# Altium schematic sheet Sheet1.SchDoc
size 431 x 279 mm; SheetNumber: 1; SheetTotal: 2
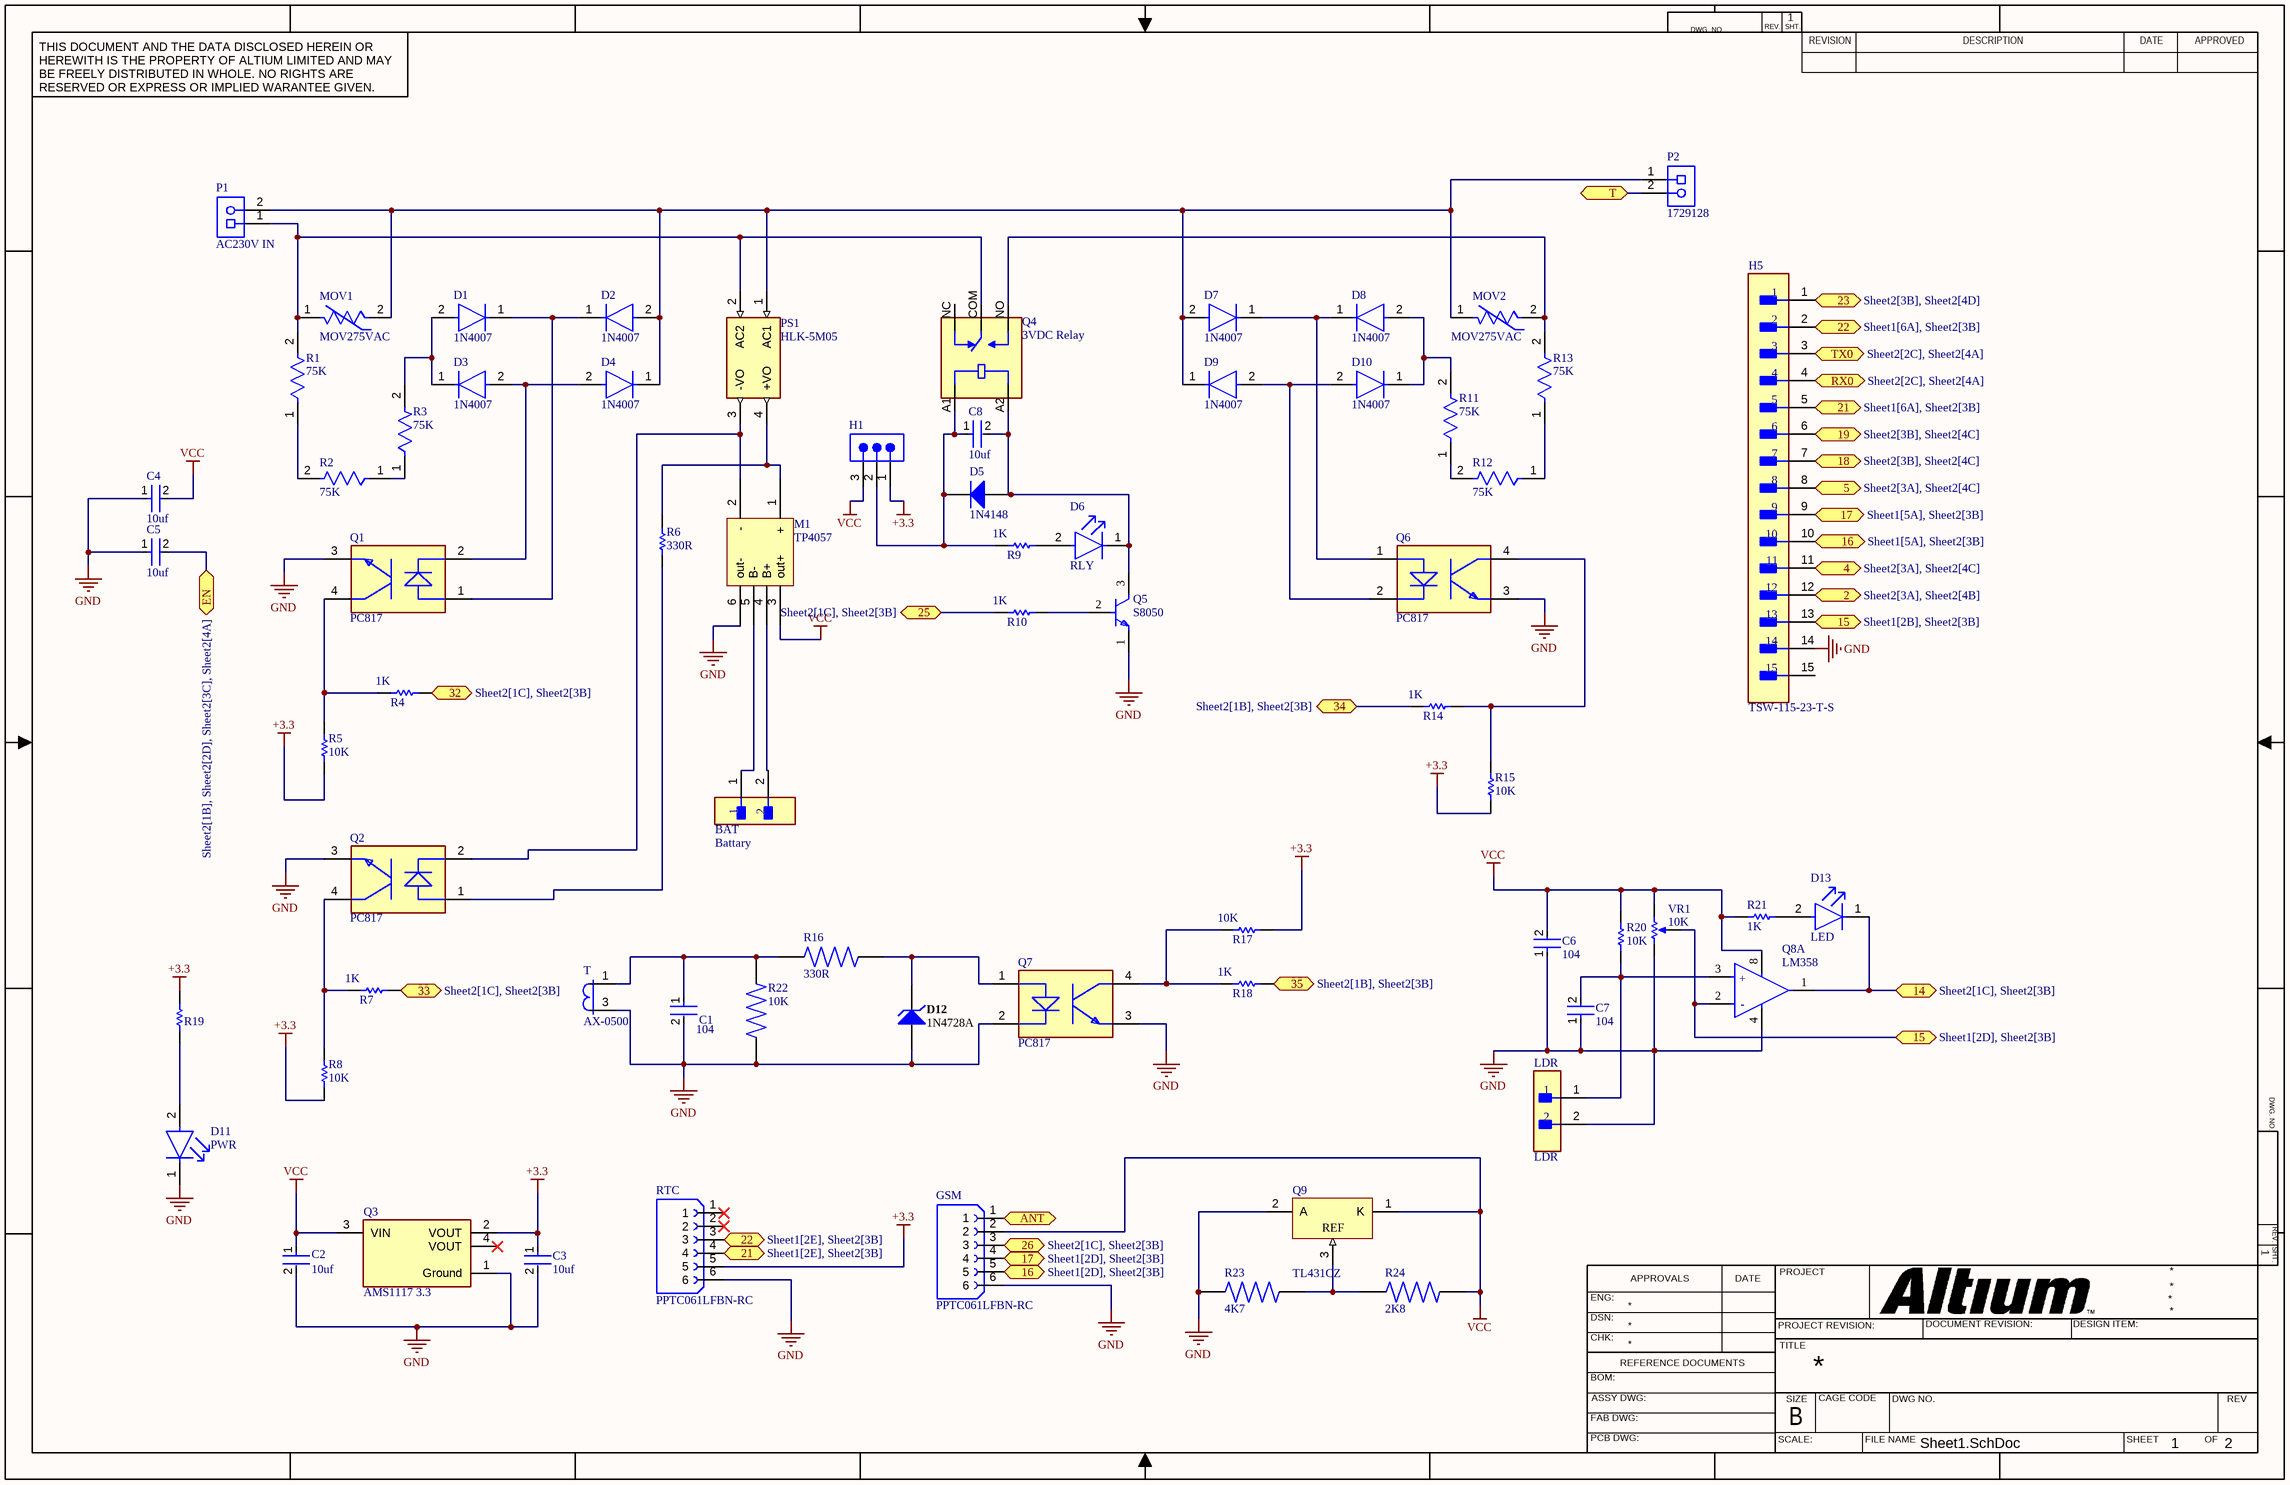
[diagram p0: Sheet1.SchDoc]

## Parts
BAT  Battary  [FP-B2B-XH-AM_LF_SN-MFG]
C1  104  [FP-GRM21B-0_1-MFG]
C2  10uf  [FP-GRM21B-0_1-MFG]
C3  10uf  [FP-GRM21B-0_1-MFG]
C4  10uf  [FP-GRM21B-0_1-MFG]
C5  10uf  [FP-GRM21B-0_1-MFG]
C6  104  [FP-GRM21B-0_1-MFG]
C7  104  [FP-GRM21B-0_1-MFG]
C8  10uf  [FP-GRM21B-0_1-MFG]
D1  1N4007  [FP-1N4007-MFG]
D2  1N4007  [FP-1N4007-MFG]
D3  1N4007  [FP-1N4007-MFG]
D4  1N4007  [FP-1N4007-MFG]
D5  1N4148  [NXP-SOD27-2_V]
D6  RLY  [FP-KP-2012QBC-D-MFG]
D7  1N4007  [FP-1N4007-MFG]
D8  1N4007  [FP-1N4007-MFG]
D9  1N4007  [FP-1N4007-MFG]
D10  1N4007  [FP-1N4007-MFG]
D11  PWR  [FP-KP-2012QBC-D-MFG]
D12  1N4728A  [FAIR-DO-41-2_V]
D13  LED  [FP-KP-2012QBC-D-MFG]
GSM  PPTC061LFBN-RC  [SULLINS_PPTC061LFBN-RC]
H1  TSW-103-07-F-S  [SMTC-TSW-103-07-X-S]  (value not drawn)
H5  TSW-115-23-T-S  [FP-TSW-115-23-T-S-MFG]
LDR  LDR  [FP-B2B-XH-AM_LF_SN-MFG]
M1  TP4057  [TP4056]
MOV1  MOV275VAC  [FP-MOV-14D431K-MFG]
MOV2  MOV275VAC  [FP-MOV-14D431K-MFG]
P1  AC230V IN  [PHOE-1729128-2_V]
P2  1729128  [PHOE-1729128-2_V]
PS1  HLK-5M05  [CONV_HLK-5M05]
Q1  PC817  [FP-PC817X1J000F-MFG]
Q2  PC817  [FP-PC817X1J000F-MFG]
Q3  AMS1117 3.3  [FP-AMS1117-IPC_A]
Q4  3VDC Relay  [RELAY_PR13-5V-450-1C]
Q5  S8050  [FP-135AN-MFG]
Q6  PC817  [FP-PC817X1J000F-MFG]
Q7  PC817  [FP-PC817X1J000F-MFG]
Q8  LM358  [FP-D0008A-IPC_B]  (part A of 2)
Q9  TL431CZ  [TO-92]
R1  75K  [FP-CFR50J2K2-MFG]
R2  75K  [FP-CFR50J2K2-MFG]
R3  75K  [FP-CFR50J2K2-MFG]
R4  1K  [RESC2013X70X40NL20T20]
R5  10K  [RESC2013X70X40NL20T20]
R6  330R  [RESC2013X70X40NL20T20]
R7  1K  [RESC2013X70X40NL20T20]
R8  10K  [RESC2013X70X40NL20T20]
R9  1K  [RESC2013X70X40NL20T20]
R10  1K  [RESC2013X70X40NL20T20]
R11  75K  [FP-CFR50J2K2-MFG]
R12  75K  [FP-CFR50J2K2-MFG]
R13  75K  [FP-CFR50J2K2-MFG]
R14  1K  [RESC2013X70X40NL20T20]
R15  10K  [RESC2013X70X40NL20T20]
R16  330R  [RESAD1100W55L680D260]
R17  10K  [RESC2013X70X40NL20T20]
R18  1K  [RESC2013X70X40NL20T20]
R19  1K  [RESC2013X70X40NL20T20]  (value not drawn)
R20  10K  [RESC2013X70X40NL20T20]
R21  1K  [RESC2013X70X40NL20T20]
R22  10K  [RESAD1100W55L680D260]
R23  4K7  [RESAD1100W55L680D260]
R24  2K8  [RESAD1100W55L680D260]
RTC  PPTC061LFBN-RC  [SULLINS_PPTC061LFBN-RC]
T  AX-0500  [INDRR1270W55L1720T953H2040_AX-0500]
VR1  10K  [BOUR-3362P]

## Ports
2 (bidir, see Sheet2[3A], Sheet2[4B]), 4 (bidir, see Sheet2[3A], Sheet2[4C]), 5 (bidir, see Sheet2[3A], Sheet2[4C]), 14 (bidir, see Sheet2[1C], Sheet2[3B]), 15 (bidir, see Sheet1[2B], Sheet2[3B]), 15 (bidir, see Sheet1[2D], Sheet2[3B]), 16 (bidir, see Sheet1[2D], Sheet2[3B]), 16 (bidir, see Sheet1[5A], Sheet2[3B]), 17 (bidir, see Sheet1[2D], Sheet2[3B]), 17 (bidir, see Sheet1[5A], Sheet2[3B]), 18 (bidir, see Sheet2[3B], Sheet2[4C]), 19 (bidir, see Sheet2[3B], Sheet2[4C]), 21 (bidir, see Sheet1[2E], Sheet2[3B]), 21 (bidir, see Sheet1[6A], Sheet2[3B]), 22 (bidir, see Sheet1[2E], Sheet2[3B]), 22 (bidir, see Sheet1[6A], Sheet2[3B]), 23 (bidir, see Sheet2[3B], Sheet2[4D]), 25 (bidir, see Sheet2[1C], Sheet2[3B]), 26 (bidir, see Sheet2[1C], Sheet2[3B]), 32 (bidir, see Sheet2[1C], Sheet2[3B]), 33 (bidir, see Sheet2[1C], Sheet2[3B]), 34 (bidir, see Sheet2[1B], Sheet2[3B]), 35 (bidir, see Sheet2[1B], Sheet2[3B]), ANT (bidir), EN (bidir, see Sheet2[1B], Sheet2[2D], Sheet2[3C], Sheet2[4A]), RX0 (bidir, see Sheet2[2C], Sheet2[4A]), T (bidir), TX0 (bidir, see Sheet2[2C], Sheet2[4A])

## Nets
+3.3: C3.1 H1.1 Q3.2(VOUT) R5.1 R8.1 R15.1 R17.1 R19.2 RTC.5
GND: C1.2 C2.2 C3.2 C4.1 C5.1 C6.1 C7.1 D11.1(C) D12.1(A) GSM.6 H5.14 LDR.2 M1.6(out-) Q1.3(E) Q2.3(E) Q3.1(Ground) Q5.1(E) Q6.3(E) Q7.2(C) Q7.3(E) Q8.4(V-) Q9.2(A) R22.2 R23.2 RTC.6 T.3 VR1.1(CCW)
VCC: C2.1 C4.2 C6.2 GSM.2 H1.3 M1.3(out+) Q3.3(VIN) Q8.8(V+) Q9.1(K) R20.1 R21.1 R24.1 VR1.3(CW)
2: H5.12 ; port 2
4: H5.11 ; port 4
5: H5.8 ; port 5
14: D13.1(C) Q8.1(OUT1) ; port 14
15: H5.13 Q8.2(IN1-) VR1.2(S) ; port 15
16: GSM.5 H5.10 ; port 16
17: GSM.4 H5.9 ; port 17
18: H5.7 ; port 18
19: H5.6 ; port 19
21: H5.5 RTC.4 ; port 21
22: H5.2 RTC.3 ; port 22
23: H5.1 ; port 23
25: R10.2 ; port 25
26: GSM.3 ; port 26
32: R4.1 ; port 32
33: R7.1 ; port 33
34: R14.2 ; port 34
35: R18.1 ; port 35
ANT: GSM.1 ; port ANT
EN: C5.2 ; port EN
RX0: H5.4 ; port RX0
T: P2.2 ; port T
TX0: H5.3 ; port TX0
NetBAT_1: BAT.1 M1.5(B-)
NetBAT_2: BAT.2 M1.4(B+)
NetC1_1: C1.1 R16.2 R22.1 T.1
NetC7_2: C7.2 LDR.1 Q8.3(IN1+) R20.2
NetC8_1: C8.1 D5.2(K) H1.2 Q4.A1(COIL1) R9.2
NetC8_2: C8.2 D5.1(A) D6.1(C) Q4.A2(COIL2) Q5.3(C)
NetD1_1: D1.1(C) D2.1(C) Q1.1(A)
NetD1_2: D1.2(A) D3.1(C) R3.2
NetD2_2: D2.2(A) D4.1(C) D7.2(A) D9.1(C) MOV1.2 MOV2.1 P1.2 P2.1 PS1.1(AC1)
NetD3_2: D3.2(A) D4.2(A) Q1.2(C)
NetD6_2: D6.2(A) R9.1
NetD7_1: D7.1(C) D8.1(C) Q6.1(A)
NetD8_2: D8.2(A) D10.1(C) R11.2
NetD9_2: D9.2(A) D10.2(A) Q6.2(C)
NetD11_2: D11.2(A) R19.1
NetD12_2: D12.2(K) Q7.1(A) R16.1
NetD13_2: D13.2(A) R21.2
NetM1_1: M1.1(+) PS1.4(+VO) R6.2
NetM1_2: M1.2(-) PS1.3(-VO) Q2.2(C)
NetMOV1_1: MOV1.1 P1.1 PS1.2(AC2) Q4.COM R1.2
NetMOV2_2: MOV2.2 Q4.NO R13.2
NetQ1_4: Q1.4(C) R4.2 R5.2
NetQ2_1: Q2.1(A) R6.1
NetQ2_4: Q2.4(C) R7.2 R8.2
NetQ5_2: Q5.2(B) R10.1
NetQ6_4: Q6.4(C) R14.1 R15.2
NetQ7_4: Q7.4(C) R17.2 R18.2
NetQ9_3: Q9.3(REF) R23.1 R24.2
NetR1_1: R1.1 R2.2
NetR2_1: R2.1 R3.1
NetR11_1: R11.1 R12.2
NetR12_1: R12.1 R13.1

Not connected (* = marked no-connect by the designer): H5 15; Q3 4(VOUT)*; Q4 NC; RTC 1* 2*

## Notes on the sheet
- DWG. NO.
- REV.
- SHT.
- THIS DOCUMENT AND THE DATA DISCLOSED HEREIN OR HEREWITH IS THE PROPERTY OF ALTIUM LIMITED AND MAY BE FREELY DISTRIBUTED IN WHOLE. NO RIGHTS ARE RESERVED OR EXPRESS OR IMPLIED WARANTEE GIVEN.
- REVISION
- DESCRIPTION
- DATE
- APPROVED
- ENG:
- APPROVALS
- PROJECT
- DSN:
- CHK:
- REFERENCE DOCUMENTS
- PROJECT REVISION:
- TITLE
- DOCUMENT REVISION:
- DESIGN ITEM:
- BOM:
- FAB DWG:
- PCB DWG:
- ASSY DWG:
- SCALE:
- SIZE
- B
- CAGE CODE
- FILE NAME
- DWG NO.
- SHEET
- OF
- REV
- (in symbol CMP-04895-000442-1, part A) +; -

## Library data of the parts
BAT LDR = CMP-17439-000037-1: CONN HEADER VERT 2POS 2.5MM; Max Voltage Rating (AC): 250V; Connector Type: Male Pin; Contact Resistance: 20mR; Max Current Rating: 3A; Number of Positions: 2; Series: XH; Contact Material: Brass; Mount: Through Hole; Housing Material: Polyamide; Contact Plating: Tin; Termination: Solder; Max Operating Temperature: 85°C; Depth: 5.75mm; Packaging: Bulk; Min Operating Temperature: -25°C; Contact Type: Male Pin; Color: Green; Pitch: 2.5mm; Length: 7.4mm; Lead Free: Lead Free; Number of Rows: 1; Fastening Type: Detent; Housing Color: White; Orientation: Straight
C1-C8 = CMP-2007-03453-2: Chip Multilayer Ceramic Capacitors for General Purpose, 0805, 10uF, X5R, 15%, 10%, 16V; Radiation Hardening: No; Thickness: 0.053inch; Voltage Rating (DC): 16V; Lead Free: Lead Free; Package Quantity: 1; Width: 1.25mm; Case Code (Imperial): 0805; Depth: 1.25mm; Packaging: Tape and Reel; Dielectric: X5R; Max Operating Temperature: 85°C; Tolerance: 10%; Voltage Rating: 16V; Voltage: 16V; Capacitance: 10uF; Height: 1.25mm; Case Code (Metric): 2012; Material: Ceramic; Mount: Surface Mount; Case/Package: 0805; REACH SVHC: No SVHC; Length: 2mm; Min Operating Temperature: -55°C; Termination: SMD/SMT
D1-D4 D7-D10 = CMP-123542-000001-1: Rectifier diode 1000 V 1 A DO-41, ,; Manufacturer: Diotec; Max Surge Forward Current: 27A; Forward Current: 1A; Max Junction Temp: +175°C; Reverse Voltage: 1000V; Value: 15pF; Peak Reverse Current: 5uA; Category: Diode; Temperature Range Low: -50°C; Automotive: No; Temperature: -50°C to +175°C; Lead Free: Yes; ComponentLink2Description: Datasheet; Max Repetitive Reverse Voltage: 1000V; ComponentLink2URL: https://datasheet.octopart.com/1N4007-Diotec-datasheet-62346875.pdf; Manufacturer Part Number: 1N4007; Device Class L3: Rectifier Diodes; Height: 2.8mm; Octopart: https://octopart.com/1n4007-diotec-4040411; Package: 1N4007; Temperature Range High: +175°C; Device Class L1: Discrete Semiconductors; Device Class L2: Diodes; RoHS: TRUE; Capacitance: 15pF; Ipc Land Pattern Name: DIOAD888W100L520D280
D5 = CMP-0648-00002-1: High-speed Diode, 100 V, 450 mA, 2-Pin SOD27, RoHS; Manufacturer: NXP Semiconductors; Configuration: Single; IR (VR: 20 V)=25 nA; IFRM: 450 mA; IFSM: 4 A Max.; Trr: 4 ns Max.; Cd: 4 pF Max.; VR: 100 V Max.; VF (IF: 10 mA)=1 V; IF: 200 mA Max.; ComponentLink1Description: Manufacturer URL; RoHS: TRUE; ComponentLink1URL: http://www.nxp.com/; ComponentLink3Description: Package Specification; DatasheetVersion: Aug-04; ComponentLink2Description: Datasheet; PackageVersion: Aug-04; PackageReference: SOD27; ComponentLink3URL: http://www.nxp.com/documents/data_sheet/1N4148_1N4448.pdf; Mounting Technology: Through Hole; ComponentLink2URL: http://www.nxp.com/documents/data_sheet/1N4148_1N4448.pdf; PartNumber: 1N4148; PackageDescription: 2-Pin Hermetically Sealed Glass Package, Axial Leaded, Dia 1.85 mm, Body Length 4.25 mm, Lead Spread 25.4 mm
D6 D11 D13 = CMP-44529-000058-1: LED, Low Power, Blue, SMD, 0805 [2012 Metric], 20 mA, 3.3 V, 465 nm; Wavelength: 465nm; Lens Color: Clear; Number of LEDs: 1; Viewing Angle: 120°; Luminous Intensity: 100mcd; Dominant Wavelength: 470nm; Forward Voltage: 3.3V; Lens Style: Diffused; Forward Current: 20mA; Color: Blue; Packaging: Tape and Reel; Width: 2mm; Number of Pins: 2; Radiation Hardening: No; Series: KP; Length: 1.25mm; REACH SVHC: No SVHC; Case/Package: 2012; Mount: Surface Mount; Height: 1.1mm; RoHS Compliant: Yes
D12 = CMP-0892-00028-1: Zener Diode, 3.3V, 1W, 5%, -65 to 200 degC, 2-Pin DO-41, Body 2.72 x 5.2 mm, RoHS; Manufacturer: Fairchild Semiconductor; PD (W): 1; VZ (Max.) (V): 3.465; IR (uA): 100; ZZ (Max) (ohm): 10; Test Current IZ (mA): 76; VZ (Min.) (V): 3.135; DatasheetVersion: Rev. H3; Tolerance: 5%; ComponentLink3URL: http://www.fairchildsemi.com/dwg/DO/DO41A.pdf; ComponentLink2Description: Datasheet; PackageDescription: 2-Pin Axial leaded, Body 2.72 x 5.2 mm, Lead Spread 25.4 mm; PartNumber: 1N4728A; Operating and Storage Temperature Range: -65 to 200 degC; Mounting Technology: Through Hole; ComponentLink3Description: Package Specification; PackageReference: DO-41-2; ComponentLink1URL: http://www.fairchildsemi.com/; RoHS: TRUE; ComponentLink1Description: Manufacturer URL; ComponentLink2URL: http://www.fairchildsemi.com/ds/1N/1N4744A.pdf; PackageVersion: Rev. 2
GSM RTC = PPTC061LFBN-RC: 6 Position Total Single Row 2.54 mm Pitch Straight Female Header; MF: Sullins Connector Solutions; MP: PPTC061LFBNRC; SnapEDA_Link: https://www.snapeda.com/parts/PPTC061LFBNRC/Sullins/view-part/?ref=snap; Package: None; Value: *; Check_prices: https://www.snapeda.com/parts/PPTC061LFBNRC/Sullins/view-part/?ref=eda
H1 = CMP-1024-00331-1: 0.025" SQ Post Header, Through-hole, Vertical, -55 to 125 degC, 2.54 mm Pitch, 3-Pin, Male, RoHS; Manufacturer: Samtec; Pitch: 2.54 mm; DatasheetVersion: F-214; ComponentLink1Description: Manufacturer URL; ComponentLink3URL: http://www.samtec.com/documents/webfiles/cpdf/TSW-XXX-XX-XXX-X-XX-XXX-MKT.pdf; Mounting Technology: Through-hole; PackageDescription: .025[0.64] SQ. Post Terminal Strip Assembly; Temperature Range: -55 to 125 degC; ComponentLink3Description: Package Specification; Orientation: Vertical; PartNumber: TSW-103-07-F-S; RoHS: True; PackageVersion: DM, 8/1988; ComponentLink2Description: Datasheet; ComponentLink1URL: http://www.samtec.com; ComponentLink2URL: http://www.samtec.com/documents/webfiles/pdf/TSW_TH.PDF; PackageReference: TSW-103-07-X-S
H5 = CMP-02766-001466-1: CONN HEADER VERT 15POS 2.54MM; Connector Type: Male Pin; Number of Contacts: 15; Gender: Male; Pitch: 0.1inch; Termination: Solder; Packaging: Bulk; Lead Free: Lead Free; Housing Color: Black; Housing Material: Plastic; Color: Black; RoHS Compliant: Yes; Contact Type: Male Pin; Width: 2.54mm; Mount: Through Hole; Contact Material: Bronze; Number of Rows: 1; Radiation Hardening: No; Number of Positions: 15; Length: 38.1mm; REACH SVHC: No SVHC; Height: 2.54mm; Contact Plating: Tin; Series: TSW; Contact Mating Length: 0.23inch
MOV1 MOV2 = CMP-07402-000008-1: VARISTOR 430V 4.5KA DISC 14MM; Manufacturer: Bourns Inc.; Manufacturer Part Number: MOV-14D431K; Voltage Tolerance: 10%; Varistor Voltage: 387V; Voltage Rating Ac: 275V; Capacitance: 552pF; Voltage Rating Dc: 350V; Value: 552pF; Clamping Current: 50A; Clamping Voltage: 710V; Mouser Description: Varistors 430volts 14mm; Temperature Range High: +105°C; RoHS: TRUE; ComponentLink2Description: Datasheet; Height: 20mm; Temperature: -40°C to +105°C; ComponentLink2URL: https://www.bourns.com/data/global/pdfs/MOV14D.pdf; Digikey Description: VARISTOR 430V 4.5KA DISC 14MM; Device Class L3: unset; Temperature Range Low: -40°C; Automotive: No; Device Class L1: Circuit Protection; Device Class L2: Varistors; Package: 0; Category: Res; Lead Free: Yes; Octopart: https://octopart.com/mov-14d431k-bourns-21388914
P1 = CMP-2000-05815-1: PCB Terminal Block, 13.5 A, 400 V, 2-Pin THD, RoHS, Bulk; PartNumber: 1729128; Manufacturer: Phoenix Contact; Package Version: 03/2015; No. of Rows: 1; Pitch: 5.08mm; No. of Positions: 2; Voltage Rating: 400V; Current Rating: 13500mA; Manufacturer URL: http://www.phoenixcontact.com/; Datasheet URL: https://datasheet.ciiva.com/16046/1729128-16046181.pdf; RoHS: TRUE; Package URL: https://www.phoenixcontact.com/online/portal/pi/pxc/product_detail_page/!ut/p/b1/3VdJjqNKFDxLH8AFycySyWY2ozFsEPOMMQaDOX1XedGL_1Vdm5YXJleknhSKeBkvI6EA8ncAo3AYoDhBQGco6KN7VURTdemj9us_IEKEZo_YHiPAEWEFmDGOHMORkqKYCORBZxgL7ZoaZYcbFFUZ3fqxSY6GOuxydWUuHqz1ynmMFygu583Bob0Ewr6Sd_l-5m-kAueHiB0jpRwZwe58wwtkpxtMYd_LmGcDRU02dRNEyWt6Y2ti5pSyJ_reIkzIulrqApdnbT11V5jnCKbYNCvhEM1MCpPByat_X379-iThf08CI5GfOPqfBeS3BRoBOdD55AKVv0iLwCMq-2BrzXWSGRH7pUGD9uwXQjiph3xL0DKQwdGa0JImiIOmBNOestqgwTHSSs2oOep-78apyXQBvNi8ZLaFjvjWvcaUEBu0MC6Wbe-d6mB0FAebo2lUWinqYaZs5DAYzV0RP9yitUjnGJ0iI9xhZkT42OCQNUJJhkgWINNQLP2JFP6OpMg3JCVg70jqHT0lvKOnhHf0lPuOnnLf0VPuWx6_dxwUIvwk5WMkT0kLL1mh61l2yZVSzG3pYV_bqo-mj6uMKwKwdnnW8Jh5RTOJzMOA5c-eJDaZQw4mTMPH02PvS_ZAqNVjVTo2WyYLkwH_KU1mmmG5kjRhDqPXLwwVHvVOjCM60-fpXvTDfMGW1PVFVS1r4e4yVDk4ZdNbkUHvqPqQSeian4UD39fNKmachqdJ1NJbyk8rXT9mXTvPk3oE5meulKGgiruPJek-4I9hTT6G8ZLOyRSm2RRVbThERQad5OS28hdt4YW4vG0stgYYzsWsK4_7y6DZMjJSCqri1kyiZR5vD7pwIrNR7QwPHTcLTI5qT7eRlpHrdGiupYlqQDJ7zy_CND8fWWBoLRXxk1RVcXiBQwbTD4Xi7KL-FuO94t9xaqweXzH; Package Description: 2-Pin Through Hole Device, Body 8.1 x 10.16 mm, Pitch 5.08 mm; Datasheet Version: 12/2013; Mounting Technology: ThroughHole; Orientation: Horizontal; Package Reference: 1729128-2; Packing: Bulk
P2 = CMP-2000-05815-1: PCB Terminal Block, 13.5 A, 400 V, 2-Pin THD, RoHS, Bulk; Manufacturer: Phoenix Contact; Package Version: 03/2015; No. of Rows: 1; Pitch: 5.08mm; No. of Positions: 2; Voltage Rating: 400V; Current Rating: 13500mA; Manufacturer URL: http://www.phoenixcontact.com/; Datasheet URL: https://datasheet.ciiva.com/16046/1729128-16046181.pdf; RoHS: TRUE; Package URL: https://www.phoenixcontact.com/online/portal/pi/pxc/product_detail_page/!ut/p/b1/3VdJjqNKFDxLH8AFycySyWY2ozFsEPOMMQaDOX1XedGL_1Vdm5YXJleknhSKeBkvI6EA8ncAo3AYoDhBQGco6KN7VURTdemj9us_IEKEZo_YHiPAEWEFmDGOHMORkqKYCORBZxgL7ZoaZYcbFFUZ3fqxSY6GOuxydWUuHqz1ynmMFygu583Bob0Ewr6Sd_l-5m-kAueHiB0jpRwZwe58wwtkpxtMYd_LmGcDRU02dRNEyWt6Y2ti5pSyJ_reIkzIulrqApdnbT11V5jnCKbYNCvhEM1MCpPByat_X379-iThf08CI5GfOPqfBeS3BRoBOdD55AKVv0iLwCMq-2BrzXWSGRH7pUGD9uwXQjiph3xL0DKQwdGa0JImiIOmBNOestqgwTHSSs2oOep-78apyXQBvNi8ZLaFjvjWvcaUEBu0MC6Wbe-d6mB0FAebo2lUWinqYaZs5DAYzV0RP9yitUjnGJ0iI9xhZkT42OCQNUJJhkgWINNQLP2JFP6OpMg3JCVg70jqHT0lvKOnhHf0lPuOnnLf0VPuWx6_dxwUIvwk5WMkT0kLL1mh61l2yZVSzG3pYV_bqo-mj6uMKwKwdnnW8Jh5RTOJzMOA5c-eJDaZQw4mTMPH02PvS_ZAqNVjVTo2WyYLkwH_KU1mmmG5kjRhDqPXLwwVHvVOjCM60-fpXvTDfMGW1PVFVS1r4e4yVDk4ZdNbkUHvqPqQSeian4UD39fNKmachqdJ1NJbyk8rXT9mXTvPk3oE5meulKGgiruPJek-4I9hTT6G8ZLOyRSm2RRVbThERQad5OS28hdt4YW4vG0stgYYzsWsK4_7y6DZMjJSCqri1kyiZR5vD7pwIrNR7QwPHTcLTI5qT7eRlpHrdGiupYlqQDJ7zy_CND8fWWBoLRXxk1RVcXiBQwbTD4Xi7KL-FuO94t9xaqweXzH; PartNumber: 1729128; Package Description: 2-Pin Through Hole Device, Body 8.1 x 10.16 mm, Pitch 5.08 mm; Datasheet Version: 12/2013; Mounting Technology: ThroughHole; Orientation: Horizontal; Package Reference: 1729128-2; Packing: Bulk
PS1 = HLK-5M05: AC DC 220V to 5V 5W 5Watt Isolated Switching Step-Down Power Supply Module Converter; MF: Hi-link; Check_prices: https://www.snapeda.com/parts/HLK-5M05/Hi-link/view-part/?ref=eda; SnapEDA_Link: https://www.snapeda.com/parts/HLK-5M05/Hi-link/view-part/?ref=snap; Price: None; Availability: Not in stock; Package: Package; MP: HLK-5M05; Value: *
Q1 Q2 Q6 Q7 = CMP-65434-000003-1: OPTOISOLATOR 5KV TRANS 4DIP; Collector Emitter Saturation Voltage: 200mV; Forward Voltage: 1.4V; Power Dissipation: 200mW; Input Current: 20mA; Max Collector Current: 50mA; Collector Emitter Breakdown Voltage: 80V; Rise Time: 18000ns; Number of Elements: 1; Reverse Breakdown Voltage: 6V; Current Transfer Ratio: 600%; Min Operating Temperature: -30°C; Number of Pins: 4; Radiation Hardening: No; Output Current per Channel: 50mA; Case/Package: DIP; Fall Time: 18000ns; Forward Current: 50mA; Isolation Voltage: 5kV; Package Quantity: 2000; Max Operating Temperature: 100°C; Packaging: Sleeve; Max Input Current: 50mA; Output Voltage: 80V; Max Power Dissipation: 200mW; Mount: Through Hole; Number of Channels: 1; Collector Emitter Voltage (VCEO): 80V
Q3 = CMP-209535-000001-1: LDO Voltage Regulators 1A, 3.3V; Manufacturer Part Number: AMS1117-3.3; Manufacturer: Advanced Monolithic Systems; Dropout Voltage: 1.1V; Output Type: Fixed; Nominal Supply Current: 5mA; Max Power Dissipation: 1.2W; Max Supply Voltage: 15V; Number Of Outputs: 1; Standoff Height: 0.64mm; Max Junction Temp: +125°C; Height: 1.8mm; Package: AMS1117; Device Class L2: Power Management ICs; ComponentLink2Description: Datasheet; ComponentLink2URL: http://www.advanced-monolithic.com/pdf/ds1117.pdf; Category: IC; RoHS: TRUE; Automotive: No; Device Class L1: Integrated Circuits (ICs); Output Current: 1A; Device Class L3: Voltage Regulators - Linear; Temperature: -40°C to +125°C; Output Voltage: 3.3V; Temperature Range Low: -40°C; Octopart: https://octopart.com/ams1117-3.3-advanced+monolithic+systems-25899300; Lead Free: Yes; Ipc Land Pattern Name: SOT229P700X180-4; Temperature Range High: +125°C
Q4 = PR13-5V-450-1C: 19 x 15.5 x 15.8 mm, 5 V, 10 A, SPDT (1 Form C), Power Relay; MF: Same Sky; SnapEDA_Link: https://www.snapeda.com/parts/PR13-5V-450-1C/Same+Sky/view-part/?ref=snap; Package: None; Value: *; MP: PR13-5V-450-1C; Check_prices: https://www.snapeda.com/parts/PR13-5V-450-1C/Same+Sky/view-part/?ref=eda
Q5 = CMP-00278-84331634-1: SS8050DBU Bipolar (BJT) Single Transistor, NPN, 25 V, 100 MHz, 1 W, 1.5 A, 160; Manufacturer Lifecycle Status: ACTIVE; Collector Base Voltage (VCBO): 40V; Power Dissipation: 1W; Max Junction Temperature (Tj): 150°C; Frequency: 100MHz; Output Power: 2W; Collector Emitter Voltage (VCEO): 25V; Max Collector Current: 1.5A; Collector Emitter Saturation Voltage: 500mV; Number of Elements: 1; Emitter Base Voltage (VEBO): 6V; hFE Min: 85; RoHS: Compliant; Lifecycle Status: Production; Lead Free: Lead Free; Transition Frequency: 100MHz; Case/Package: TO-92; Width: 3.86mm; Min Operating Temperature: -65°C; Element Configuration: Single; Gain Bandwidth Product: 100MHz; REACH SVHC: No SVHC; Max Frequency: 100MHz; Radiation Hardening: No; Current Rating: 1.5A; Mount: Through Hole; Max Operating Temperature: 150°C; Polarity: NPN; Number of Pins: 3; Collector Emitter Breakdown Voltage: 25V; Schedule B: 8541290080, 8541290080|8541290080|8541290080|8541290080|8541290080; Packaging: Bulk; Weight: 179mg; NexarPartId: 84331634; Voltage Rating (DC): 25V; Max Power Dissipation: 1W; Height: 4.58mm; Length: 4.58mm
Q8 = CMP-04895-000442-1: IC OPAMP GP 2 CIRCUIT 8SOIC; Output Current per Channel: 40mA; Input Offset Voltage (Vos): 1mV; Operating Supply Current: 90uA; Number of Circuits: 2; Input Bias Current: 15pA; Slew Rate: 1.5V/µs; Gain Bandwidth Product: 1MHz; Number of Pins: 8; Mount: Surface Mount; Packaging: Cut Tape; RoHS Compliant: Yes; Case/Package: SOIC; Min Operating Temperature: -40°C; Max Operating Temperature: 125°C
Q9 = CMP-0242-00004-1: Programmable Voltage Reference, 2.5 to 36V, 3-Pin TO-92; ComponentLink2URL: http://www.st.com/internet/com/TECHNICAL_RESOURCES/TECHNICAL_LITERATURE/DATASHEET/CD00000986.pdf; ComponentLink1Description: Manufacturer URL; PackageVersion: 2011; ComponentLink2Description: Datasheet; PackageReference: TO-92; ComponentLink1URL: http://www.st.com; DatasheetVersion: Oct-2011; PackageDescription: TO, Flat Index; 3 In-Line, Axial Leads; Body Dia. 4.7mm; Lead Dia. 0.56 mm (max)
R1-R3 R11-R13 = CMP-03212-000011-1: RES 2.2K OHM 5% 1/2W AXIAL; Temperature Coefficient: 0ppm/°C; Max Power Dissipation: 500mW; Resistance: 2.2kR; Number of Resistors: 1; Voltage Rating (DC): 350V; Case/Package: Axial; Number of Terminations: 2; REACH SVHC: No SVHC; Mount: Axial; Packaging: Cut Tape; Min Operating Temperature: -55°C; Series: CFR50, Neohm; Resistor Type: Thin Film; Tolerance: 5%; Radiation Hardening: No; Package Quantity: 3000; Power Rating: 500mW; Length: 9mm; Termination: Axial; Max Operating Temperature: 155°C; ELV: Compliant; Voltage Rating: 350V; Resistance Tolerance: 5%; Technology: CARBON FILM; Diameter: 3mm; RoHS Compliant: Yes
R4-R10 R14 R15 R17-R21 = CMP-2001-04376-1: Manufacturer: Panasonic; Part Number: ERJ-6ENF1002V
R16 R22-R24 = MFR-25FBF52-1K: 1.07 kOhms Â±1% 0.25W, 1/4W Through Hole Resistor Axial - Metal Film; MF: Yageo; SnapEDA_Link: https://www.snapeda.com/parts/MFR-25FBF52-1K/Yageo/view-part/?ref=snap; Package: RADIAL-2 YAGEO; Value: *; MP: MFR-25FBF52-1K; Check_prices: https://www.snapeda.com/parts/MFR-25FBF52-1K/Yageo/view-part/?ref=eda
T = AX-0500: 5A Current Sense Transformer 50Hz ~ 60Hz Through Hole; MF: Talema Group LLC; Package: Talema Group LLC; Price: None; Value: *; MP: AX-0500; SnapEDA_Link: https://www.snapeda.com/parts/AX-0500/Talema%20Group%20LLC/view-part/3208690/?ref=snap; Availability: Unavailable
VR1 = CMP-1747-00004-1: Square Trimpot(R) Trimming Potentiometer, 10 KOhm, 300 V, -55 to 125 degC, 3-Pin THD, RoHS, Tube; Voltage Rating: 220 mV; Power Rating: 1 W; Tolerance: 1%; Resistance: 50 mohm; Case/Package: 1206; Length: 3.2 mm; RoHSCompliant: True; PackageDescription: 3-Pin Through Hole Device, Body 6.6 x 6.99 mm, Pitch 2.54 mm; ComponentLink2Description: Datasheet; REACH SVHC: No SVHC; Mount: Surface Mount; Height: 0.6 mm; Packaging: Tape and Reel; ComponentLink1URL: http://www.bourns.com/; Case Code (Imperial): 0612; Pins: 2; Case Code (Metric): 1632; ComponentLink2URL: http://www.bourns.com/docs/Product-Datasheets/3362.pdf; Min Operating Temperature: -25degC; ComponentLink1Description: Manufacturer URL; PackageReference: 3326P; Max Operating Temperature: 125degC; Width: 1.6 mm; Package Quantity: 5000; DatasheetVersion: May-16